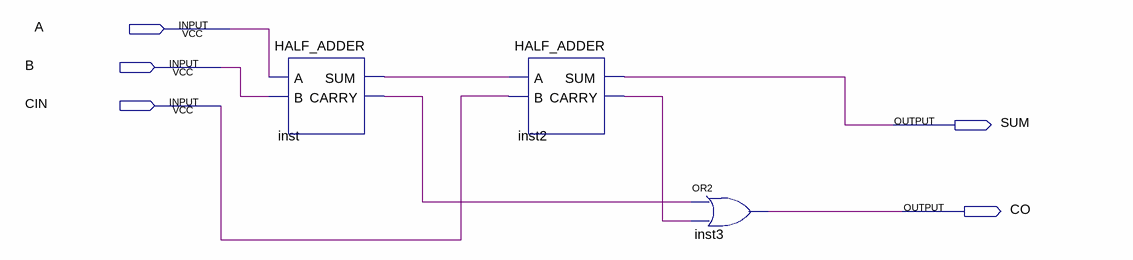
[diagram p0: schematic sheet]
// Quartus schematic FULL_ADDER.bdf as structural Verilog: 3 symbols, 5 pins
module FULL_ADDER (
  input  A,
  input  B,
  input  CIN,
  output SUM,
  output CO
);

  wire inst2_carry, inst_carry, inst_sum;

  HALF_ADDER inst (.A(A), .B(B), .SUM(inst_sum), .CARRY(inst_carry));
  HALF_ADDER inst2 (.A(inst_sum), .B(CIN), .SUM(SUM), .CARRY(inst2_carry));
  or inst3 (CO, inst_carry, inst2_carry);
endmodule
